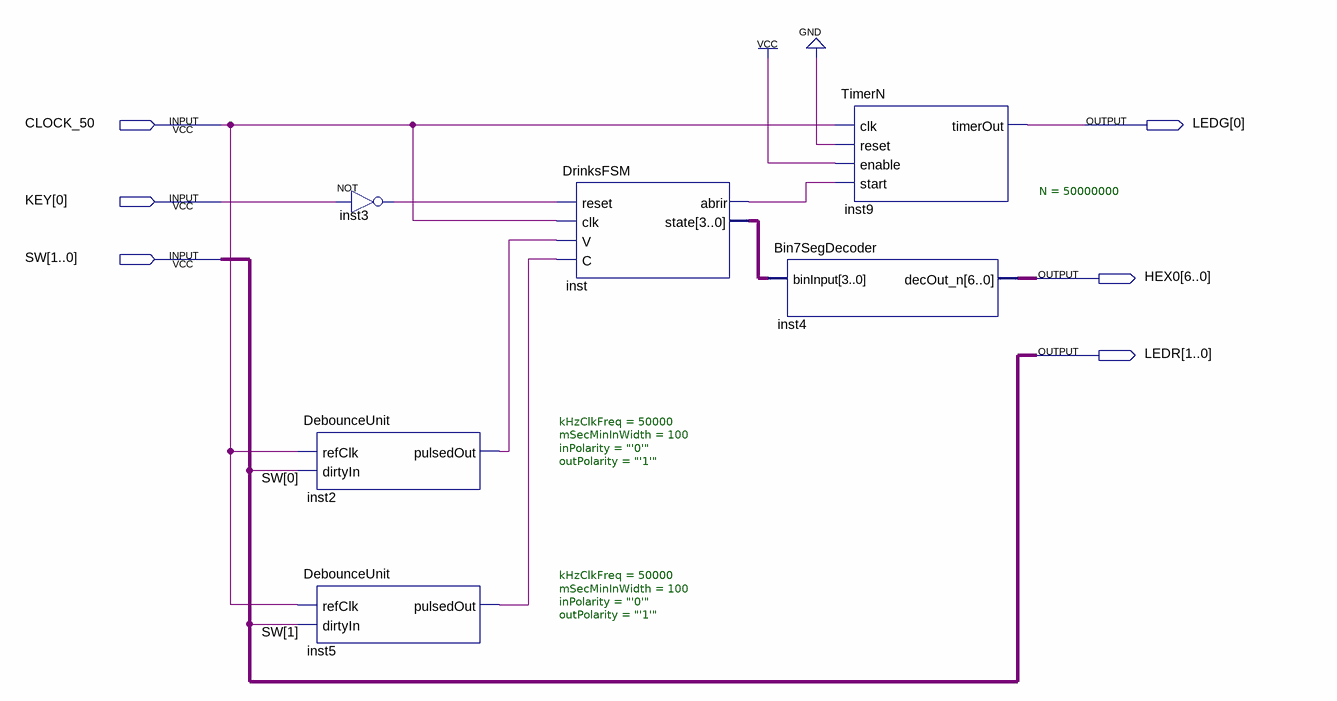
[diagram p0: schematic sheet]
// Quartus schematic DrinksMachine.bdf as structural Verilog: 6 symbols, 6 pins
module DrinksMachine (
  input  CLOCK_50,
  input  [0:0] KEY,
  input  [1:0] SW,
  output [0:0] LEDG,
  output [6:0] HEX0,
  output [1:0] LEDR
);

  wire inst2_pulsedout, inst3_out, inst5_pulsedout, inst_abrir;
  wire [3:0] inst_state;

  DebounceUnit #(.kHzClkFreq(50000), .mSecMinInWidth(100), .inPolarity("'0'"), .outPolarity("'1'")) inst2 (
    .refClk(CLOCK_50), .dirtyIn(SW[0]), .pulsedOut(inst2_pulsedout));
  DebounceUnit #(.kHzClkFreq(50000), .mSecMinInWidth(100), .inPolarity("'0'"), .outPolarity("'1'")) inst5 (
    .refClk(CLOCK_50), .dirtyIn(SW[1]), .pulsedOut(inst5_pulsedout));
  not inst3 (inst3_out, KEY[0]);
  DrinksFSM inst (
    .reset(inst3_out), .clk(CLOCK_50), .V(inst2_pulsedout), .C(inst5_pulsedout), .abrir(inst_abrir),
    .state(inst_state));
  Bin7SegDecoder inst4 (.binInput(inst_state), .decOut_n(HEX0));
  TimerN #(.N(50000000)) inst9 (.clk(CLOCK_50), .reset(1'b0), .enable(1'b1), .start(inst_abrir), .timerOut(LEDG[0]));

  assign LEDR = SW;
endmodule
